# EAGLE design devkit-r1 (EAGLE 9.6.2)
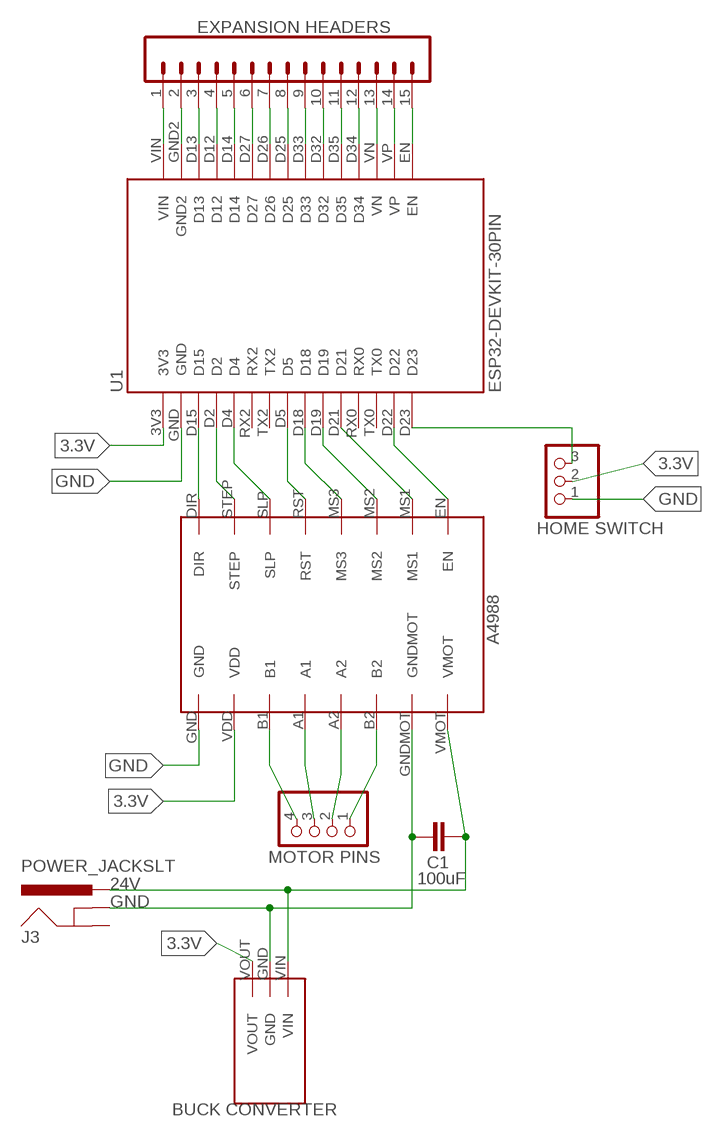
[diagram p0: schematic, sheet 1]

## Parts
BUCK  BUCK-CONVERTERBUCK-CONVERTER  [BUCK-CONVERTER]
C1  C2,5-3  [C2.5-3]
J1  CONN_15  [1X15]
J3  POWER_JACKSLT  [POWER_JACK_SLOT]
JP1  PINHD-1X4  [1X04]
JP2  PINHD-1X3  [1X03]
U1  ESP32-DEVKIT-30PIN  [ESP32-DEVKIT-30PIN]
U$1  A4988A4988  [A4988]

## Nets
3.3V: BUCK.VOUT JP2.2 U1.3V3 U$1.VDD
24V: BUCK.VIN C1.2 J3.PWR U$1.VMOT
GND: BUCK.GND C1.1 J3.GND@1(GNDBREAK) JP2.1 U1.GND U$1.GND U$1.GNDMOT
N$1: JP2.3 U1.D23
N$2: U1.D22 U$1.EN
N$3: JP1.4 U$1.B1
N$4: JP1.3 U$1.A1
N$5: JP1.2 U$1.A2
N$6: JP1.1 U$1.B2
N$7: U1.D21 U$1.MS1
N$8: U1.D19 U$1.MS2
N$9: U1.D18 U$1.MS3
N$10: U1.D5 U$1.RST
N$11: U1.D4 U$1.SLP
N$12: U1.D2 U$1.STEP
N$13: U1.D15 U$1.DIR
N$15: J1.1 U1.VIN
N$16: J1.2 U1.GND2
N$17: J1.3 U1.D13
N$18: J1.4 U1.D12
N$19: J1.5 U1.D14
N$20: J1.6 U1.D27
N$21: J1.7 U1.D26
N$22: J1.8 U1.D25
N$23: J1.9 U1.D33
N$24: J1.10 U1.D32
N$25: J1.11 U1.D35
N$26: J1.12 U1.D34
N$27: J1.13 U1.VN
N$28: J1.14 U1.VP
N$29: J1.15 U1.EN
Unconnected: J3.GND@2(GND) U1.RX0 U1.RX2 U1.TX2

## Power pins joined to a net without a drawn wire
TX0: U1.TX0

## Library data of the parts
BUCK = buck-converter:BUCK-CONVERTER: buck converter; LABEL: BUCK CONVERTER
C1 = capacitor-wima:C: CAPACITOR naming: grid - package width; CAPACITANCE: 100uF
J1 = sparkfun_connectors:CONN_15: Multi connection point. Often used as Generic Header-pin footprint for 0.1 inch spaced/style header connections On any of the 0.1 inch spaced packages, you can populate with these: Break Away Headers - Straight <https://www.sparkfun.com/products/116> (PRT-00116) Break Away Male Headers - Right Angle <https://www.sparkfun.com/products/553> (PRT-00553) Female Headers <https://www.sparkfun.com/products/115> (PRT-00115) Break Away Headers - Machine Pin <https://www.sparkfun.com/products/117> (PRT-00117) Break Away Female Headers - Swiss Machine Pin <https://www.sparkfun.com/products/743> (PRT-00743) For SCREWTERMINALS and SPRING TERMINALS visit here: Screw Terimnals on SparkFun.com <https://www.sparkfun.com/search/results?term=Screw+Terminals> (5mm/3.5mm/2.54mm spacing) This device is also useful as a general connection point to wire up your design to another part of your project. Our various solder wires solder well into these plated through hole pads. Hook-Up Wire - Assortment (Stranded, 22 AWG) <https://www.sparkfun.com/products/11375> (PRT-11375) Hook-Up Wire - Assortment (Solid Core, 22 AWG) <https://www.sparkfun.com/products/11367> (PRT-11367) View the entire wire category on our website here <https://www.sparkfun.com/categories/141> Special notes: Molex polarized connector foot print use with SKU : PRT-08231 with associated crimp pins and housings. 1MM SMD Version SKU: PRT-10208 NOTES ON THE VARIANTS LOCK and LOCK_LONGPADS... This footprint was designed to help hold the alignment of a through-hole component (i.e. 6-pin header) while soldering it into place. You may notice that each hole has been shifted either up or down by 0.005 of an inch from it's more standard position (which is a perfectly straight line). This slight alteration caused the pins (the squares in the middle) to touch the edges of the holes. Because they are alternating, it causes a "brace" to hold the component in place. 0.005 has proven to be the perfect amount of "off-center" position when using our standard breakaway headers. Although looks a little odd when you look at the bare footprint, once you have a header in there, the alteration is very hard to notice. Also,if you push a header all the way into place, it is covered up entirely on the bottom side.; TITLE: EXPANSION HEADERS
J3 = sparkfun_connectors:POWER_JACK: Power Jack Connector This is the standard 5.5mm barrel jack for power. The PTH is the most common, proven, reliable, footprint. The Slot footprint only works if the mill layer is transmitted to the PCB fab house so be warned. Here are the connectors we sell at SparkFun: DC Barrel Power Jack/Connector <https://www.sparkfun.com/products/119> (PRT-00119) DC Barrel Power Jack/Connector (SMD) <https://www.sparkfun.com/products/12748> (PRT-12748) DC Barrel Jack Adapter - Breadboard Compatible <https://www.sparkfun.com/products/10811> (PRT-10811) It is used on this SparkFun product (and many, many others): SparkFun RedBoard - Programmed with Arduino <https://www.sparkfun.com/products/12757> (DEV-12757) Also, if you need a mating power supply or connector, please check these out: Wall Adapter Power Supply - 9VDC 650mA <https://www.sparkfun.com/products/298> (TOL-00298) DC Barrel Jack Adapter - Male <https://www.sparkfun.com/products/10287> (PRT-10287); PROD_ID: PRT-00119
JP1 = pinhead:PINHD-1X4: PIN HEADER; TITLE: MOTOR PINS
JP2 = pinhead:PINHD-1X3: PIN HEADER; TITLE: HOME SWITCH
U1 = ESP32-devkit-30pin:ESP32-DEVKIT-30PIN: Eval Board For Esp-Wroom-32 Check prices <https://pricing.snapeda.com/parts/ESP32-DEVKITC-32D/Espressif%20Systems/view-part?ref=eda>; AVAILABILITY: Warning; DESCRIPTION: WiFi Development Tools (802.11) ESP32 General Development Kit, ESP32-WROOM-32D on the board; MF: Espressif Systems; MP: ESP32-DEVKITC-32D; PACKAGE: None; PRICE: None; PURCHASE-URL: https://pricing.snapeda.com/search/part/ESP32-DEVKITC-32D/?ref=eda
U$1 = A4498:A4988: A4988 stepper driver; TITLE: A4988

## Board
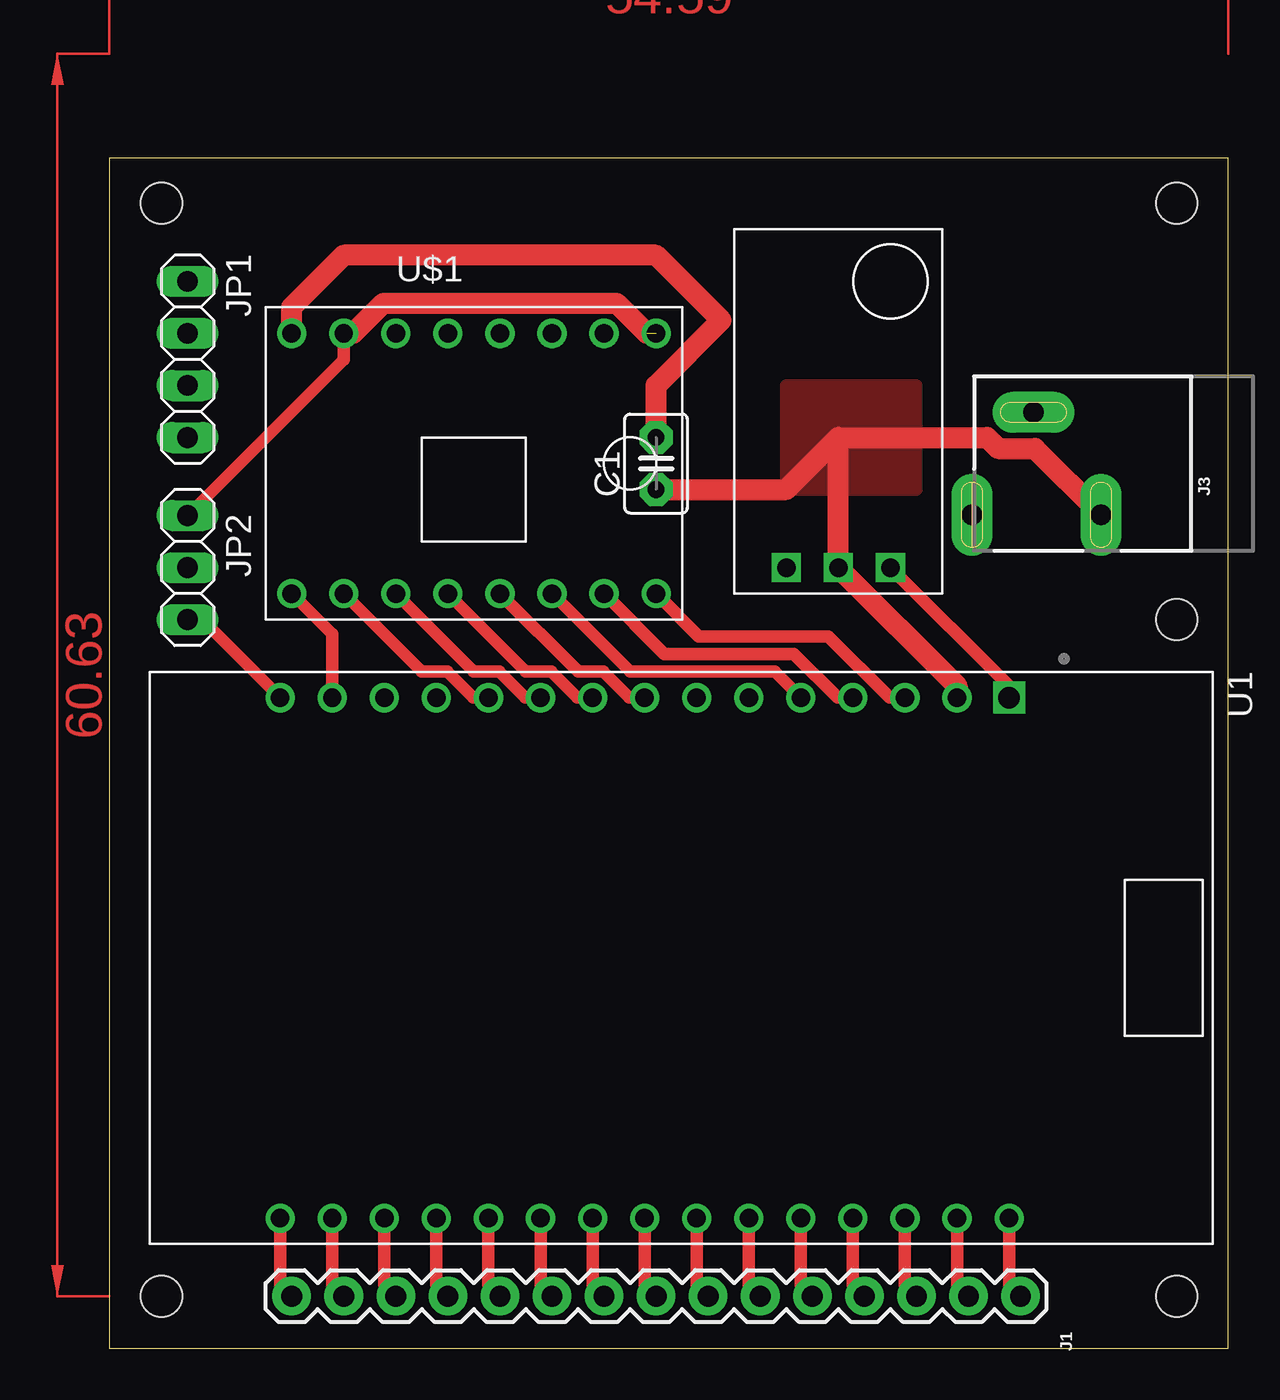
[diagram p1: board, top side]
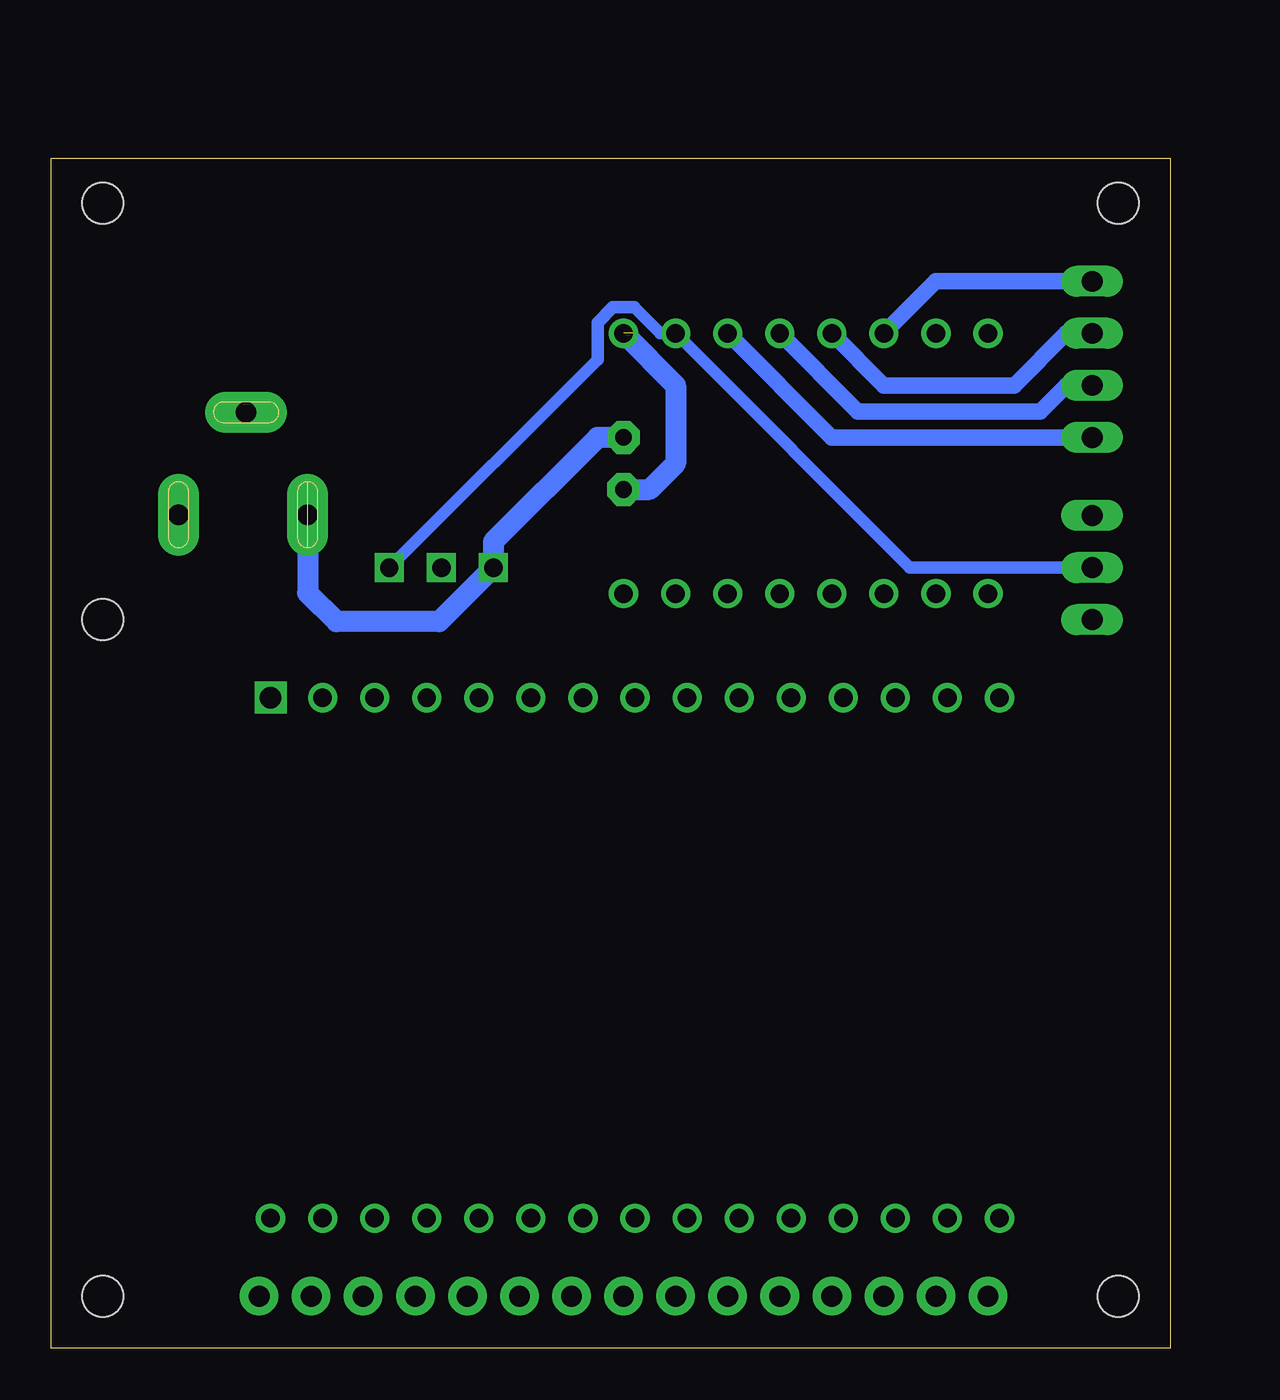
[diagram p2: board, bottom side, seen from below]

Size 54.59 x 58.09 mm. Coordinates in mm from the lower left corner, seen from the top.
Outline: 0,0 54.59,0 54.59,58.09 0,58.09 0,0
Copper layers (1*16): Top 0.035mm / dielectric 1.5mm / Bottom 0.035mm
Design rules "default *": minimum track width 6mil, minimum drill 16mil, track to track 10mil, track to pad 10mil, pad to pad 10mil, via to via 10mil, smd to smd 6mil, copper to edge 40mil, drill to drill 6mil, minimum pad ring 10mil, minimum via ring 8mil, stop-mask expansion 4mil, vias tented up to drill 0mil, thermal gap 10mil
Holes 2 mm at 2.54,55.88 52.07,55.88 52.07,35.56 52.07,2.54 2.54,2.54

### Footprints (pad centres in the part's own frame; a part is rotated, then mirrored left to right if it is on the bottom)
BUCK-CONVERTER = drill 0.9 pad 1.422 square: GND 5.08,-16.51; VIN 2.54,-16.51; VOUT 7.62,-16.51
C2.5-3 = drill 0.813 pad 1.6 octagon: 1 -1.27,0; 2 1.27,0
1X15 = drill 1.016 pad 1.88: 1 0,0; 2 2.54,0; 3 5.08,0; 4 7.62,0; 5 10.16,0; 6 12.7,0; 7 15.24,0; 8 17.78,0; 9 20.32,0; 10 22.86,0; 11 25.4,0; 12 27.94,0; 13 30.48,0; 14 33.02,0; 15 35.56,0
POWER_JACK_SLOT = drill 1 pad 2 long: GND@1 2.58,7.5; GND@2 7.58,10.8; PWR 2.58,13.8
1X04 = drill 1.016 long: 1 -3.81,0; 2 -1.27,0; 3 1.27,0; 4 3.81,0
1X03 = drill 1.016 long: 1 -2.54,0; 2 0,0; 3 2.54,0
ESP32-DEVKIT-30PIN = drill 1.04 square: 3V3 -12.7,17.22 | drill 0.9 pad 1.422: D2 -12.7,9.6; D4 -12.7,7.06; D5 -12.7,-0.56; D12 12.7,9.6; D13 12.7,12.14; D14 12.7,7.06; D15 -12.7,12.14; D18 -12.7,-3.1; D19 -12.7,-5.64; D21 -12.7,-8.18; D22 -12.7,-15.8; D23 -12.7,-18.34; D25 12.7,-0.56; D26 12.7,1.98; D27 12.7,4.52; D32 12.7,-5.64; D33 12.7,-3.1; D34 12.7,-10.72; D35 12.7,-8.18; EN 12.7,-18.34; GND -12.7,14.68; GND2 12.7,14.68; RX0 -12.7,-10.72; RX2 -12.7,4.52; TX0 -12.7,-13.26; TX2 -12.7,1.98; VIN 12.7,17.22; VN 12.7,-13.26; VP 12.7,-15.8
A4988 = drill 0.9 pad 1.422: A1 11.43,13.97; A2 8.89,13.97; B1 13.97,13.97; B2 6.35,13.97; DIR 19.05,1.27; EN 1.27,1.27; GND 19.05,13.97; GNDMOT 3.81,13.97; MS1 3.81,1.27; MS2 6.35,1.27; MS3 8.89,1.27; RST 11.43,1.27; SLP 13.97,1.27; STEP 16.51,1.27; VDD 16.51,13.97; VMOT 1.27,13.97

### Placement (x,y rotation side)
BUCK  30.48,54.61 0 top
C1  26.67,43.18 90 top
J1  44.45,2.54 180 top
J3  55.88,38.1 90 top
JP1  3.81,48.26 270 top
JP2  3.81,38.1 270 top
U1  26.67,19.05 270 top
U$1  7.62,35.56 0 top

### Tracks (layer width: path | path; a pad name or v marks a point on that pad's centre or on a via)
3.3V
  Top 0.61: BUCK.VOUT 43.89,32.31 U1.3V3
  Bottom 0.61: JP2.2 12.7,38.1 U$1.VDD 24.87,49.53 26.14,50.8 27.2,50.8 27.94,50.06 27.94,48.26 BUCK.VOUT
24V
  Top 1.016: C1.2 26.67,46.99 29.84,50.16 26.67,53.34 11.43,53.34 8.89,50.8 U$1.VMOT
  Bottom 1.016: C1.2 27.94,44.45 33.02,39.37 BUCK.VIN 35.66,35.46 40.67,35.46 42.08,36.87 J3.PWR
GND  (1 unrouted)
  Top 0.61: JP2.1 11.43,48.26 U$1.GNDMOT
  Top 1.016: U$1.GNDMOT 11.89,49.53 13.36,51 24.74,51 26.21,49.53 | 35.56,44.45 33.02,41.91 C1.1 | 35.56,44.45 BUCK.GND 41.35,32.31 U1.GND | 35.56,44.45 42.82,44.45 43.35,43.92 45.14,43.92 J3.GND@1
  Bottom 1.016: C1.1 25.4,41.91 24.13,43.18 24.13,46.99 U$1.GND
  pour Top: 33.02,46.99 39.37,46.99 39.37,41.91 33.02,41.91
N$1
  Top 0.61: U1.D23 4.52,35.56 JP2.3
N$2
  Top 0.61: U$1.EN 10.87,34.85 U1.D22
N$3
  Bottom 0.152: 21.54,49.63 U$1.B1
  Bottom 0.813: U$1.B1 16.51,44.45 JP1.4
N$4
  Bottom 0.813: U$1.A1 15.24,45.72 6.35,45.72 5.08,46.99 JP1.3
N$5
  Bottom 0.813: JP1.2 5.08,49.53 7.62,46.99 13.97,46.99 U$1.A2
N$6
  Bottom 0.813: U$1.B2 11.43,52.07 JP1.1
N$7
  Top 0.61: U$1.MS1 15.24,33.02 16.48,33.02 17.75,31.75 U1.D21
N$8
  Top 0.61: U$1.MS2 17.78,33.02 19.02,33.02 20.29,31.75 U1.D19
N$9
  Top 0.61: U$1.MS3 20.32,33.02 21.56,33.02 22.83,31.75 U1.D18
N$10
  Top 0.61: U$1.RST 22.86,33.02 24.1,33.02 25.37,31.75 U1.D5
N$11
  Top 0.61: U$1.SLP 25.4,33.02 32.46,33.02 U1.D4
N$12
  Top 0.61: U$1.STEP 27.08,33.88 33.39,33.88 35.53,31.75 U1.D2
N$13
  Top 0.61: U$1.DIR 28.75,34.75 35.07,34.75 38.07,31.75 U1.D15
N$15
  Top 0.61: J1.1 43.89,3.1 U1.VIN
N$16
  Top 0.61: J1.2 41.35,3.1 U1.GND2
N$17
  Top 0.61: J1.3 38.81,3.1 U1.D13
N$18
  Top 0.61: J1.4 36.27,3.1 U1.D12
N$19
  Top 0.61: J1.5 33.73,3.1 U1.D14
N$20
  Top 0.61: J1.6 31.19,3.1 U1.D27
N$21
  Top 0.61: J1.7 28.65,3.1 U1.D26
N$22
  Top 0.61: J1.8 26.11,3.1 U1.D25
N$23
  Top 0.61: J1.9 23.57,3.1 U1.D33
N$24
  Top 0.61: J1.10 21.03,3.1 U1.D32
N$25
  Top 0.61: J1.11 18.49,3.1 U1.D35
N$26
  Top 0.61: J1.12 15.95,3.1 U1.D34
N$27
  Top 0.61: J1.13 13.41,3.1 U1.VN
N$28
  Top 0.61: J1.14 10.87,3.1 U1.VP
N$29
  Top 0.61: J1.15 8.33,3.1 U1.EN
(copper drawn outside any net)
  shapes: Top area x2